# Altium project ST_linkV2.PrjPcb
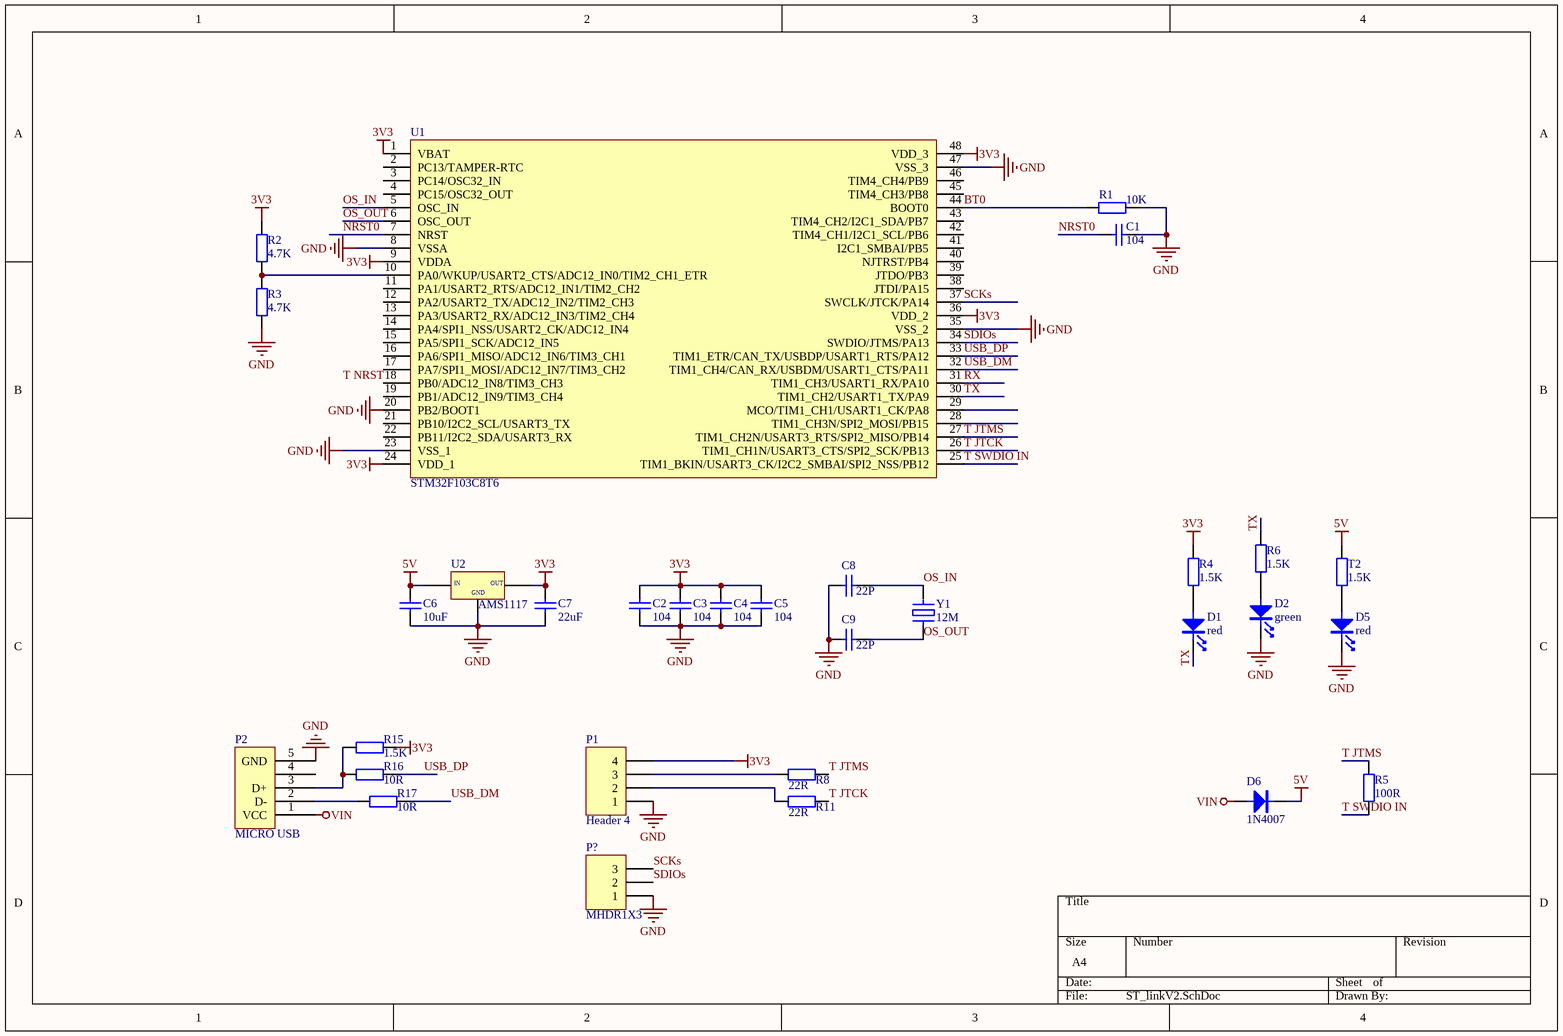
[diagram p0: ST_linkV2.SchDoc]
1 sheet, 31 parts. Net scope: global (net labels, ports and power ports of the same name join across sheets).
Board file: ST_linkV2.PcbDoc

## Sheet ST_linkV2.SchDoc
size A4

### Parts
C1  104  [电容_C0603]
C2  104  [电容_C0603]
C3  104  [电容_C0603]
C4  104  [电容_C0603]
C5  104  [电容_C0603]
C6  10uF  [电容_C1206]
C7  22uF  [电容_C1206]
C8  22P  [电容_C0603]
C9  22P  [电容_C0603]
D1  red  [LED_0603]
D2  green  [LED_0603]
D5  red  [LED_0603]
D6  1N4007  [二极管_SOD-123]
P1  Header 4  [HDR1X4]
P2  MICRO USB  [接插件_MICRO 牛角插座 USB 卷边]
P?  MHDR1X3  [MHDR1X3]
R1  10K  [电阻_R0603]
R2  4.7K  [电阻_R0603]
R3  4.7K  [电阻_R0603]
R4  1.5K  [电阻_R0603]
R5  100R  [电阻_R0603]
R6  1.5K  [电阻_R0603]
R8  22R  [电阻_R0603]
R11  22R  [电阻_R0603]
R15  1.5K  [电阻_R0603]
R16  10R  [电阻_R0603]
R17  10R  [电阻_R0603]
T2  1.5K  [电阻_R0603]
U1  STM32F103C8T6  [ST主控_LQFP48]
U2  AMS1117  [稳压芯片_SOT-89]
Y1  12M  [晶振_5032]

### Nets
3V3: C2.1 C3.1 C4.1 C5.1 C7.2 P1.4 R2.2 R4.2 R15.1 U1.1(VBAT) U1.9(VDDA) U1.24(VDD_1) U1.36(VDD_2) U1.48(VDD_3) U2.2(OUT)
5V: C6.2 D6.K T2.2 U2.3(VIN)
GND: C1.2 C2.2 C3.2 C4.2 C5.2 C6.1 C7.1 C8.2 C9.2 D2.K D5.K P1.1 P2.0 P2.5(GND) P?.1 R1.1 R3.1 U1.8(VSSA) U1.20(PB2/BOOT1) U1.23(VSS_1) U1.35(VSS_2) U1.47(VSS_3) U2.1(GND) Y1.0
VIN: D6.A P2.1(VCC)
BT0: R1.2 U1.44(BOOT0)
NRST0: C1.1 U1.7(NRST)
OS_IN: C8.1 U1.5(OSC_IN) Y1.2
OS_OUT: C9.1 U1.6(OSC_OUT) Y1.1
RX: U1.31(TIM1_CH3/USART1_RX/PA10)
SCKs: P?.3 U1.37(SWCLK/JTCK/PA14)
SDIOs: P?.2 U1.34(SWDIO/JTMS/PA13)
T JTCK: R11.1 U1.26(TIM1_CH1N/USART3_CTS/SPI2_SCK/PB13)
T JTMS: R5.2 R8.1 U1.27(TIM1_CH2N/USART3_RTS/SPI2_MISO/PB14)
T SWDIO IN: R5.1 U1.25(TIM1_BKIN/USART3_CK/I2C2_SMBAI/SPI2_NSS/PB12)
TX: D1.K R6.2 U1.30(TIM1_CH2/USART1_TX/PA9)
USB_DM: R17.1 U1.32(TIM1_CH4/CAN_RX/USBDM/USART1_CTS/PA11)
USB_DP: R16.1 U1.33(TIM1_ETR/CAN_TX/USBDP/USART1_RTS/PA12)
NetD1_A: D1.A R4.1
NetD2_A: D2.A R6.1
NetD5_A: D5.A T2.1
NetP1_2: P1.2 R11.2
NetP1_3: P1.3 R8.2
NetP2_2: P2.2(D-) R17.2
NetP2_3: P2.3(D+) R15.2 R16.2
NetR2_1: R2.1 R3.2 U1.10(PA0/WKUP/USART2_CTS/ADC12_IN0/TIM2_CH1_ETR)

Not connected (* = marked no-connect by the designer): P2 4; U1 2(PC13/TAMPER-RTC) 3(PC14/OSC32_IN) 4(PC15/OSC32_OUT) 11(PA1/USART2_RTS/ADC12_IN1/TIM2_CH2) 12(PA2/USART2_TX/ADC12_IN2/TIM2_CH3) 13(PA3/USART2_RX/ADC12_IN3/TIM2_CH4) 14(PA4/SPI1_NSS/USART2_CK/ADC12_IN4) 15(PA5/SPI1_SCK/ADC12_IN5) 16(PA6/SPI1_MISO/ADC12_IN6/TIM3_CH1) 17(PA7/SPI1_MOSI/ADC12_IN7/TIM3_CH2) 18(PB0/ADC12_IN8/TIM3_CH3) 19(PB1/ADC12_IN9/TIM3_CH4) 21(PB10/I2C2_SCL/USART3_TX) 22(PB11/I2C2_SDA/USART3_RX) 28(TIM1_CH3N/SPI2_MOSI/PB15) 29(MCO/TIM1_CH1/USART1_CK/PA8) 38(JTDI/PA15) 39(JTDO/PB3) 40(NJTRST/PB4) 41(I2C1_SMBAI/PB5) 42(TIM4_CH1/I2C1_SCL/PB6) 43(TIM4_CH2/I2C1_SDA/PB7) 45(TIM4_CH3/PB8) 46(TIM4_CH4/PB9)

### Notes on the sheet
- Labels drawn without touching a wire or pin: T NRST
- (in symbol AMS1117) IN

### Library data of the parts
C1-C9 = cap: U: 50V; 参数: Cap,0805,X7R,104K,50V,125C,±10%
  C1-C5: C: 104
  C6: C: 10uF
  C7: C: 22uF
  C8 C9: C: 22P
D1 D2 D5 = LED: 参数: LED,0603,Red
D6 = Diode: 参数: Rectifier Diode,DO-41,1N4007,1KV,1A,150C,Tape
P1 = Header 4: Header, 4-Pin; LatestRevisionDate: 17-Jul-2002; LatestRevisionNote: Re-released for DXP Platform.; Publisher: Altium Limited
P2 = MICRO USB 5PIN: _Comma: ,; _Name: Port; _Specification: Port,MICRO USB,5PIN; _Value: 5PIN; _Model: MICRO USB
P? = MHDR1X3: Header, 3-Pin; LatestRevisionDate: 17-Jul-2002; LatestRevisionNote: Re-released for DXP Platform.; Publisher: Altium Limited
R1-R6 R8 R11 R15-R17 T2 = Res: P: 1/8W; 参数: Res,0805,0R,±1%,1/8W,100ppm,155C
  R1: R: 10K
  R2 R3: R: 4.7K
  R4 R6 R15 T2: R: 1.5K
  R5: R: 100R
  R8 R11: R: 22R
  R16 R17: R: 10R
Y1 = XTAL_B: F: 12M